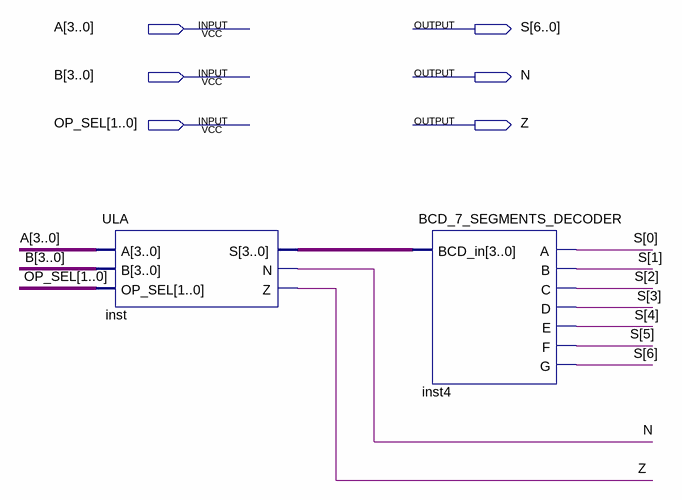
[diagram p0: schematic sheet]
// Quartus schematic ULA_BCD_7_SEGMENTS.bdf as structural Verilog: 2 symbols, 6 pins
module ULA_BCD_7_SEGMENTS (
  input  [3:0] A,
  input  [3:0] B,
  input  [1:0] OP_SEL,
  output [6:0] S,
  output N,
  output Z
);

  wire [3:0] inst_s;

  ULA inst (.A(A), .B(B), .OP_SEL(OP_SEL), .S(inst_s), .N(N), .Z(Z));
  BCD_7_SEGMENTS_DECODER inst4 (.BCD_in(inst_s), .A(S[0]), .B(S[1]), .C(S[2]), .D(S[3]), .E(S[4]), .F(S[5]), .G(S[6]));
endmodule
